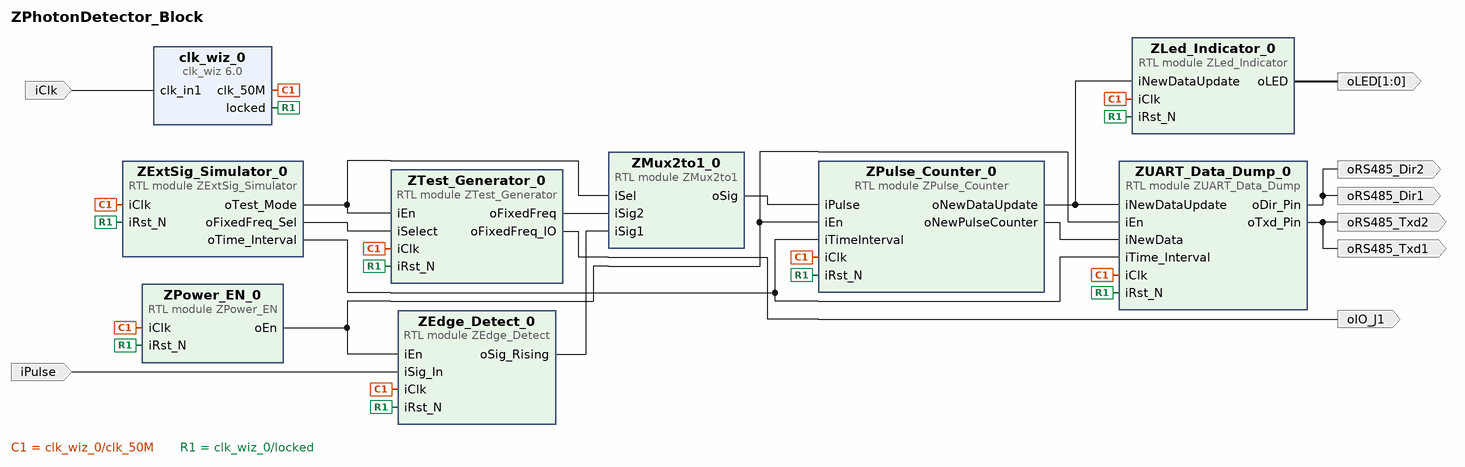
[diagram p0: block diagram of the top level]
# Vivado block design ZPhotonDetector_Block, xc7s25ftgb196-1, Vivado 2023.1
create_bd_design ZPhotonDetector_Block

create_bd_port -dir I -type clk iClk
set_property -dict {CONFIG.FREQ_HZ 100000000} [get_bd_ports iClk]
create_bd_port -dir O -from 1 -to 0 -type data oLED
create_bd_port -dir I -type intr iPulse
create_bd_port -dir O oIO_J1
create_bd_port -dir O -type data oRS485_Dir2
create_bd_port -dir O -type data oRS485_Txd2
create_bd_port -dir O -type data oRS485_Txd1
create_bd_port -dir O oRS485_Dir1

create_bd_cell -type ip -vlnv xilinx.com:ip:clk_wiz:6.0 clk_wiz_0
set_property -dict [list \
  CONFIG.CLKOUT1_DRIVES BUFG \
  CONFIG.CLKOUT1_JITTER 130.958 \
  CONFIG.CLKOUT1_PHASE_ERROR 98.575 \
  CONFIG.CLKOUT2_DRIVES BUFG \
  CONFIG.CLKOUT2_JITTER 114.829 \
  CONFIG.CLKOUT2_PHASE_ERROR 98.575 \
  CONFIG.CLKOUT2_REQUESTED_OUT_FREQ 200.000 \
  CONFIG.CLKOUT2_USED true \
  CONFIG.CLKOUT3_DRIVES BUFG \
  CONFIG.CLKOUT3_JITTER 151.636 \
  CONFIG.CLKOUT3_PHASE_ERROR 98.575 \
  CONFIG.CLKOUT3_REQUESTED_OUT_FREQ 50.000 \
  CONFIG.CLKOUT3_USED true \
  CONFIG.CLKOUT4_DRIVES BUFG \
  CONFIG.CLKOUT5_DRIVES BUFG \
  CONFIG.CLKOUT6_DRIVES BUFG \
  CONFIG.CLKOUT7_DRIVES BUFG \
  CONFIG.CLK_OUT1_PORT clk_100M \
  CONFIG.CLK_OUT2_PORT clk_200M \
  CONFIG.CLK_OUT3_PORT clk_50M \
  CONFIG.MMCM_BANDWIDTH OPTIMIZED \
  CONFIG.MMCM_CLKFBOUT_MULT_F 10 \
  CONFIG.MMCM_CLKOUT0_DIVIDE_F 10 \
  CONFIG.MMCM_CLKOUT1_DIVIDE 5 \
  CONFIG.MMCM_CLKOUT2_DIVIDE 20 \
  CONFIG.MMCM_COMPENSATION ZHOLD \
  CONFIG.NUM_OUT_CLKS 3 \
  CONFIG.PRIMITIVE PLL \
  CONFIG.PRIM_IN_FREQ 100.000 \
  CONFIG.USE_RESET false \
] [get_bd_cells clk_wiz_0]
create_bd_cell -type module -reference ZPower_EN ZPower_EN_0
create_bd_cell -type module -reference ZEdge_Detect ZEdge_Detect_0
create_bd_cell -type module -reference ZMux2to1 ZMux2to1_0
create_bd_cell -type module -reference ZUART_Data_Dump ZUART_Data_Dump_0
create_bd_cell -type module -reference ZTest_Generator ZTest_Generator_0
create_bd_cell -type module -reference ZLed_Indicator ZLed_Indicator_0
create_bd_cell -type module -reference ZExtSig_Simulator ZExtSig_Simulator_0
create_bd_cell -type module -reference ZPulse_Counter ZPulse_Counter_0

# ---- connections ----

connect_bd_net [get_bd_pins ZEdge_Detect_0/oSig_Rising] [get_bd_pins ZMux2to1_0/iSig1]
connect_bd_net [get_bd_pins ZExtSig_Simulator_0/oFixedFreq_Sel] [get_bd_pins ZTest_Generator_0/iSelect]
connect_bd_net [get_bd_pins ZExtSig_Simulator_0/oTest_Mode] [get_bd_pins ZMux2to1_0/iSel] [get_bd_pins ZTest_Generator_0/iEn]
connect_bd_net [get_bd_pins ZLed_Indicator_0/oLED] [get_bd_ports oLED]
connect_bd_net [get_bd_pins ZMux2to1_0/oSig] [get_bd_pins ZPulse_Counter_0/iPulse]
connect_bd_net [get_bd_pins ZPulse_Counter_0/oNewDataUpdate] \
  [get_bd_pins ZUART_Data_Dump_0/iNewDataUpdate] [get_bd_pins ZLed_Indicator_0/iNewDataUpdate]
connect_bd_net [get_bd_pins ZPulse_Counter_0/oNewPulseCounter] [get_bd_pins ZUART_Data_Dump_0/iNewData]
connect_bd_net [get_bd_pins ZTest_Generator_0/oFixedFreq] [get_bd_pins ZMux2to1_0/iSig2]
connect_bd_net [get_bd_pins ZTest_Generator_0/oFixedFreq_IO] [get_bd_ports oIO_J1]
connect_bd_net [get_bd_pins ZUART_Data_Dump_0/oDir_Pin] [get_bd_ports oRS485_Dir2] [get_bd_ports oRS485_Dir1]
connect_bd_net [get_bd_pins ZUART_Data_Dump_0/oTxd_Pin] [get_bd_ports oRS485_Txd2] [get_bd_ports oRS485_Txd1]
connect_bd_net [get_bd_pins clk_wiz_0/clk_50M] \
  [get_bd_pins ZPower_EN_0/iClk] [get_bd_pins ZEdge_Detect_0/iClk] [get_bd_pins ZUART_Data_Dump_0/iClk] \
  [get_bd_pins ZTest_Generator_0/iClk] [get_bd_pins ZLed_Indicator_0/iClk] [get_bd_pins ZExtSig_Simulator_0/iClk] \
  [get_bd_pins ZPulse_Counter_0/iClk]
connect_bd_net [get_bd_ports iClk] [get_bd_pins clk_wiz_0/clk_in1]
connect_bd_net -net iEn_1 [get_bd_pins ZPower_EN_0/oEn] \
  [get_bd_pins ZEdge_Detect_0/iEn] [get_bd_pins ZUART_Data_Dump_0/iEn] [get_bd_pins ZPulse_Counter_0/iEn]
connect_bd_net [get_bd_ports iPulse] [get_bd_pins ZEdge_Detect_0/iSig_In]
connect_bd_net -net iRst_N_1 [get_bd_pins clk_wiz_0/locked] \
  [get_bd_pins ZPower_EN_0/iRst_N] [get_bd_pins ZEdge_Detect_0/iRst_N] [get_bd_pins ZUART_Data_Dump_0/iRst_N] \
  [get_bd_pins ZTest_Generator_0/iRst_N] [get_bd_pins ZLed_Indicator_0/iRst_N] [get_bd_pins ZExtSig_Simulator_0/iRst_N] \
  [get_bd_pins ZPulse_Counter_0/iRst_N]
connect_bd_net -net iTimeInterval_1 [get_bd_pins ZExtSig_Simulator_0/oTime_Interval] \
  [get_bd_pins ZUART_Data_Dump_0/iTime_Interval] [get_bd_pins ZPulse_Counter_0/iTimeInterval]

validate_bd_design
save_bd_design
